# Altium schematic sheet LED_Controller.SchDoc
size A4
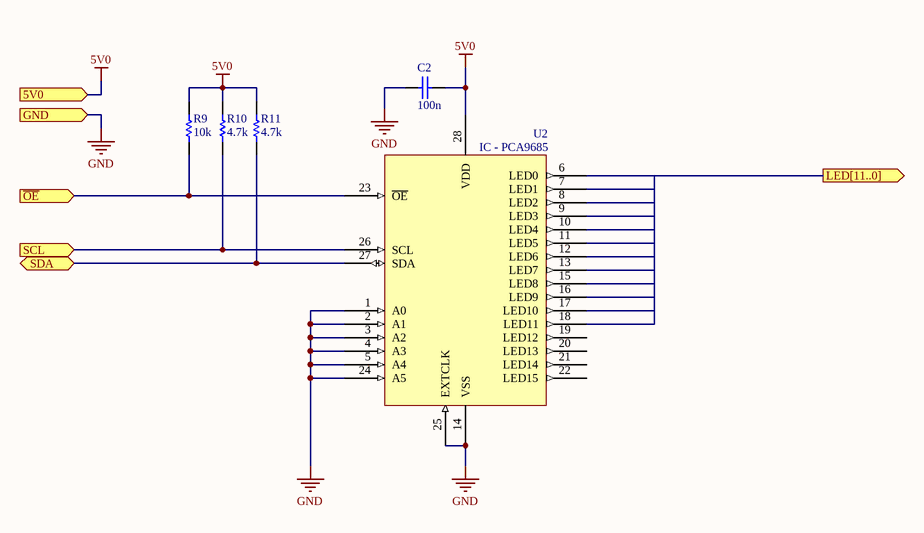
[diagram p0: LED_Controller.SchDoc]

## Parts
C2  value 100n  [CS-0603]  (hidden comment: CS - CAPACITOR)
R9  value 10k  [RS-0402]  (hidden comment: RS - RESISTOR)
R10  value 4.7k  [RS-0402]  (hidden comment: RS - RESISTOR)
R11  value 4.7k  [RS-0402]  (hidden comment: RS - RESISTOR)
U2  IC - PCA9685  [IC-TSSOP-28]

## Ports
5V0, GND, LED[11..0] (out), SCL (in), SDA (bidir), ~{OE} (in)

## Nets
5V0: C2.1 R9.2 R10.2 R11.2 U2.28(VDD) ; port 5V0
GND: C2.2 U2.1(A0) U2.2(A1) U2.3(A2) U2.4(A3) U2.5(A4) U2.14(VSS) U2.24(A5) U2.25(EXTCLK) ; port GND
~{OE}: R9.1 U2.23(~{OE}) ; port ~{OE}
SCL: R10.1 U2.26(SCL) ; port SCL
SDA: R11.1 U2.27(SDA) ; port SDA

Not connected (* = marked no-connect by the designer): U2 6(LED0) 7(LED1) 8(LED2) 9(LED3) 10(LED4) 11(LED5) 12(LED6) 13(LED7) 15(LED8) 16(LED9) 17(LED10) 18(LED11) 19(LED12) 20(LED13) 21(LED14) 22(LED15)

## Library data of the parts
C2 = CS - CAPACITOR: TOLERANCE: 10%; VOLTAGE: 16V; Supplier 1: *; Supplier Part Number 1: *; (FIELD A): *; (FLIED C): *; (FIELD B): *; Manufacturer: *
R9-R11 = RS - RESISTOR: TOLERANCE: RES TOL; POWER: RES POWER; Supplier Part Number 1: *; Supplier 1: *; (FIELD A): *; (FLIED C): *; (FIELD B): *; Manufacturer: *
U2 = IC - PCA9685: 16-channel, 12-bit PWM Fm + I2C-bus LED controller; Manufacturer: Allegro; Supplier 1: Digi-Key; Supplier Part Number 1: 568-11925-2-ND; (FLIED A): *; (FLIED B): *; (FLIED C): *